# Altium schematic sheet F405RG_Core.SchDoc
size A4
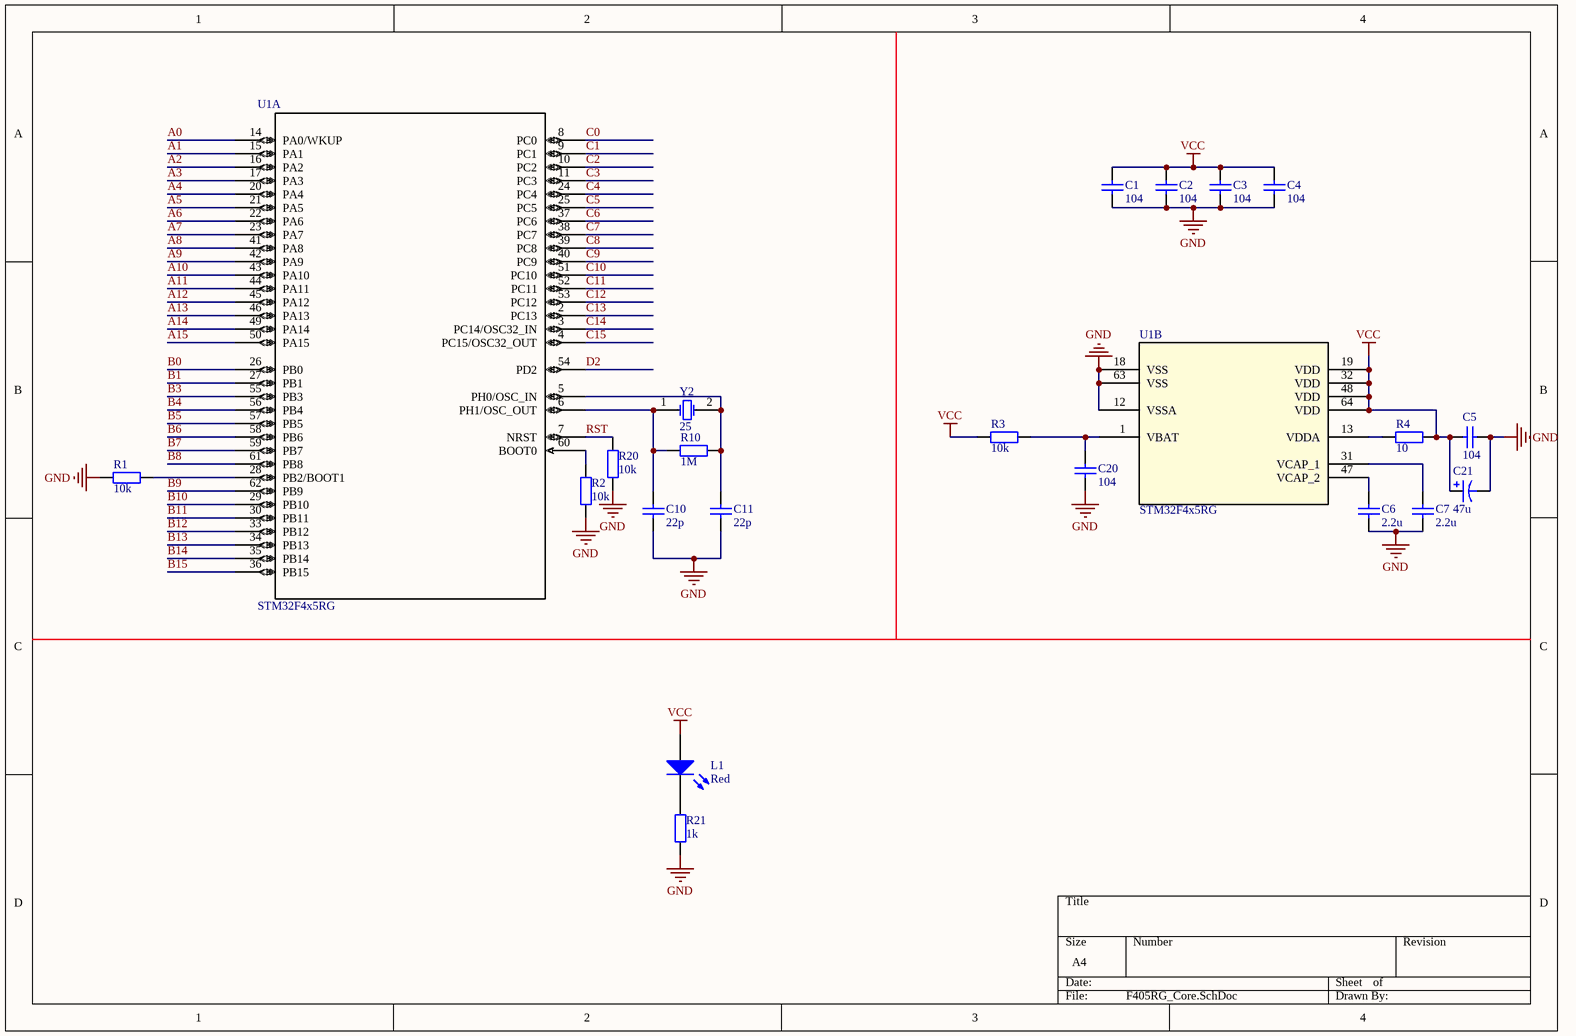
[diagram p0: F405RG_Core.SchDoc]

## Parts
C1  104  [0603]
C2  104  [0603]
C3  104  [0603]
C4  104  [0603]
C5  104  [0603]
C6  2.2u  [0603]
C7  2.2u  [0603]
C10  22p  [0603]
C11  22p  [0603]
C20  104  [0603]
C21  47u  [3528]
L1  Red  [0805]
R1  10k  [0603]
R2  10k  [0603]
R3  10k  [0603]
R4  10  [0603]
R10  1M  [0603]
R20  10k  [0603]
R21  1k  [0603]
U1  STM32F4x5RG  [LQFP64-10x10mm]  (parts A,B of 2)
Y2  25  [3225-4]

## Nets
GND: C1.1 C2.1 C3.1 C4.1 C5.2 C6.1 C7.1 C10.2 C11.2 C20.1 C21.1 R1.1 R2.2 R20.1 R21.1 U1.12(VSSA) U1.18(VSS) U1.63(VSS)
VCC: C1.2 C2.2 C3.2 C4.2 C5.1 C21.2 L1.1(A) R3.1 R4.2 U1.19(VDD) U1.32(VDD) U1.48(VDD) U1.64(VDD)
A0: U1.14(PA0/WKUP)
A1: U1.15(PA1)
A2: U1.16(PA2)
A3: U1.17(PA3)
A4: U1.20(PA4)
A5: U1.21(PA5)
A6: U1.22(PA6)
A7: U1.23(PA7)
A8: U1.41(PA8)
A9: U1.42(PA9)
A10: U1.43(PA10)
A11: U1.44(PA11)
A12: U1.45(PA12)
A13: U1.46(PA13)
A14: U1.49(PA14)
A15: U1.50(PA15)
B0: U1.26(PB0)
B1: U1.27(PB1)
B3: U1.55(PB3)
B4: U1.56(PB4)
B5: U1.57(PB5)
B6: U1.58(PB6)
B7: U1.59(PB7)
B8: U1.61(PB8)
B9: U1.62(PB9)
B10: U1.29(PB10)
B11: U1.30(PB11)
B12: U1.33(PB12)
B13: U1.34(PB13)
B14: U1.35(PB14)
B15: U1.36(PB15)
C0: U1.8(PC0)
C1: U1.9(PC1)
C2: U1.10(PC2)
C3: U1.11(PC3)
C4: U1.24(PC4)
C5: U1.25(PC5)
C6: U1.37(PC6)
C7: U1.38(PC7)
C8: U1.39(PC8)
C9: U1.40(PC9)
C10: U1.51(PC10)
C11: U1.52(PC11)
C12: U1.53(PC12)
C13: U1.2(PC13)
C14: U1.3(PC14/OSC32_IN)
C15: U1.4(PC15/OSC32_OUT)
D2: U1.54(PD2)
RST: R20.2 U1.7(NRST)
NetC6_2: C6.2 U1.47(VCAP_2)
NetC7_2: C7.2 U1.31(VCAP_1)
NetC10_1: C10.1 R10.2 U1.6(PH1/OSC_OUT) Y2.1(OSC1)
NetC11_1: C11.1 R10.1 U1.5(PH0/OSC_IN) Y2.2(OSC2)
NetC20_2: C20.2 R3.2 U1.1(VBAT)
NetL1_2: L1.2(K) R21.2
NetR1_2: R1.2 U1.28(PB2/BOOT1)
NetR2_1: R2.1 U1.60(BOOT0)
NetR4_1: R4.1 U1.13(VDDA)

## Library data of the parts
C1-C7 C10 C11 C20 = C: Capacitor; Published: 8-Jun-2000; LatestRevisionDate: 17-Jul-2002; LatestRevisionNote: Re-released for DXP Platform.; PackageReference: RAD-0.3; Publisher: Altium Limited; PackageDescription: Radial Cap, Thru-Hole; 2 Leads; 0.3 in Pin Spacing
C21 = Cp: Polarized Capacitor (Axial); Published: 8-Jun-2000; LatestRevisionDate: 17-Jul-2002; LatestRevisionNote: Re-released for DXP Platform.; PackageReference: POLAR0.8; Publisher: Altium Limited; PackageDescription: Polarized Capacitor; 2 Leads
L1 = LED: Published: 8-Jun-2000; LatestRevisionDate: 08-Jul-2005; LatestRevisionNote: Mech Layer 1 removed.; PackageReference: LED-0; Publisher: Altium Limited; PackageDescription: LED; 2 Leads
R1-R4 R10 R20 R21 = R: Resistor; Published: 8-Jun-2000; LatestRevisionDate: 17-Jul-2002; LatestRevisionNote: Re-released for DXP Platform.; PackageReference: AXIAL-0.4; Publisher: Altium Limited; PackageDescription: Axial Device, Thru-Hole; 2 Leads; 0.4 in Pin Spacing
U1 = STM32F4x5RG: Mcu; Vendor: STMicroelectronics; C: Copyright (C) 2016 Accelerated Designs. All rights reserved; Manufacturer_Part_Number: stm32f4x5rg; Copyright: Copyright (C) 2016 Accelerated Designs. All rights reserved; RefDes: RefDes; Type: Type; Value: Value
Y2 = XTAL: Crystal Oscillator; pin to pad: 2>3; Published: 8-Jun-2000; LatestRevisionDate: 17-Jul-2002; LatestRevisionNote: Re-released for DXP Platform.; Publisher: Altium Limited